# EAGLE design lqfp_adapters (EAGLE 7.4.0)
LQFP adapters for STM32 MCU
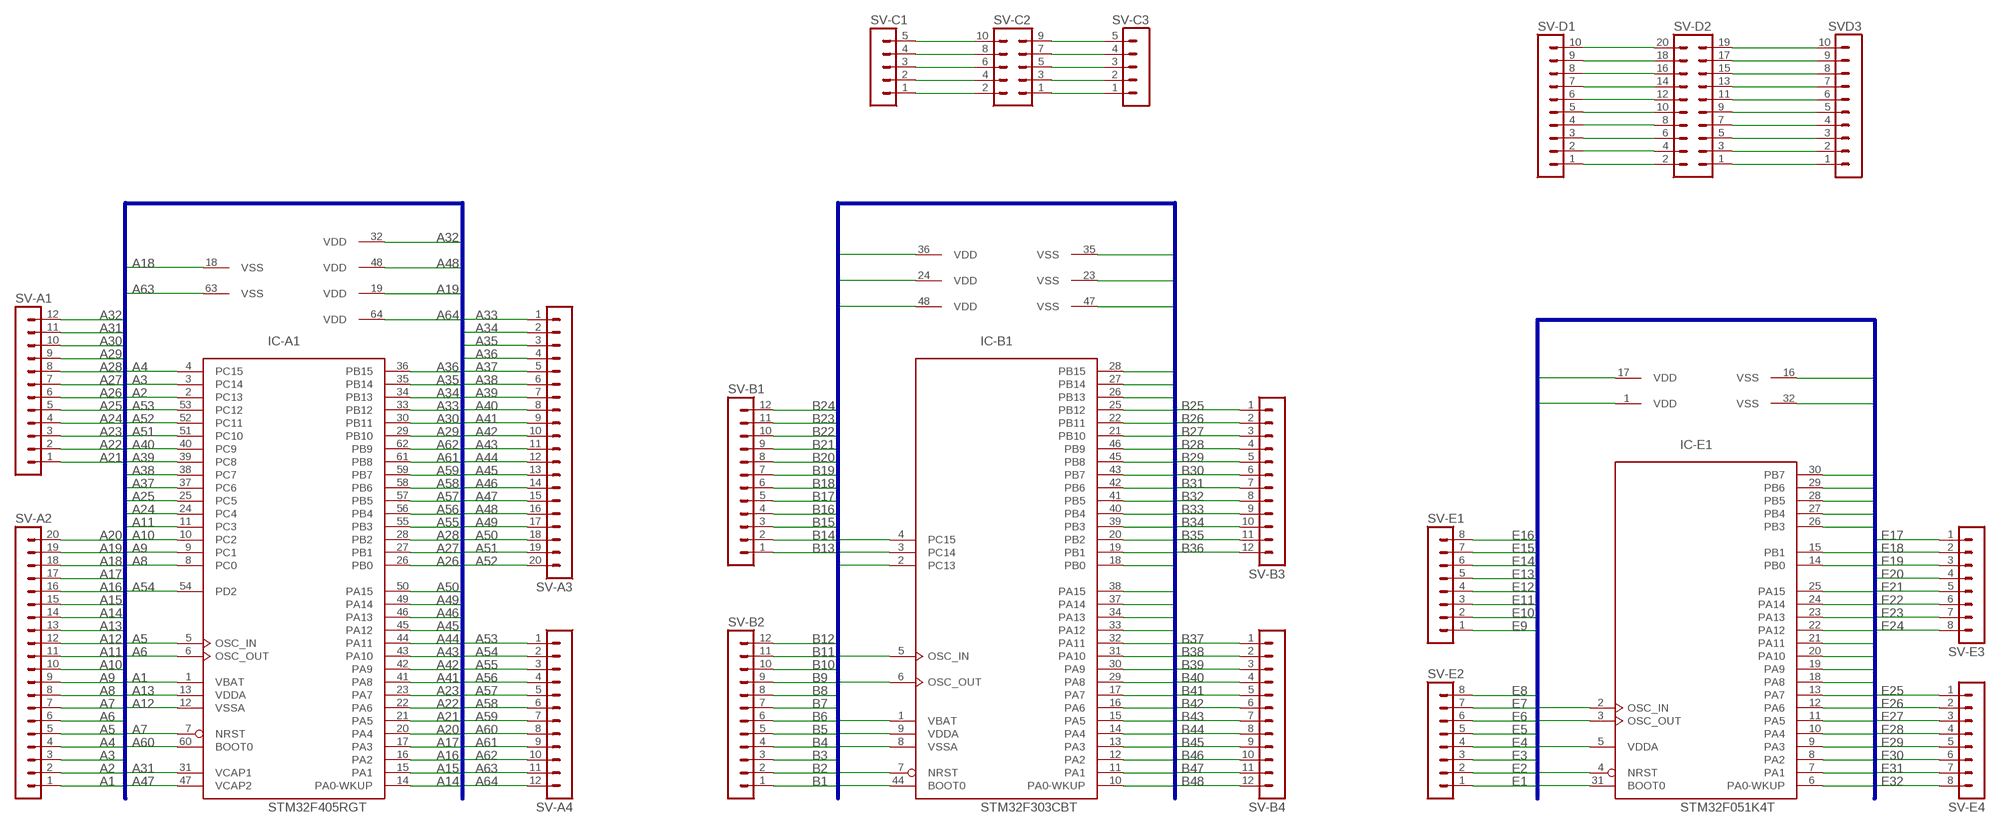
[diagram p0: schematic, sheet 1]

## Parts
IC-A1  STM32F405RGT  [LQFP64]
IC-B1  STM32F303CBT  [LQFP48]
IC-E1  STM32F051K4T  [LQFP32]
SV-A1  MA12-1NO-PL  [MA12-1-NO-PL]
SV-A2  MA20-1NO-PL  [MA20-1-NO-PL]
SV-A3  MA20-1NO-PL  [MA20-1-NO-PL]
SV-A4  MA12-1NO-PL  [MA12-1-NO-PL]
SV-B1  MA12-1NO-PL  [MA12-1-NO-PL]
SV-B2  MA12-1NO-PL  [MA12-1-NO-PL]
SV-B3  MA12-1NO-PL  [MA12-1-NO-PL]
SV-B4  MA12-1NO-PL  [MA12-1-NO-PL]
SV-C1  MA05-1NO-PL  [MA05-1-NO-PL]
SV-C2  MA05-2  [MA05-2]
SV-C3  MA05-1NO-PL  [MA05-1-NO-PL]
SV-D1  MA10-1NO-PL  [MA10-1-NO-PL]
SV-D2  MA10-2  [MA10-2]
SV-E1  MA08-1NO-PL  [MA08-1-NO-PL]
SV-E2  MA08-1NO-PL  [MA08-1-NO-PL]
SV-E3  MA08-1NO-PL  [MA08-1-NO-PL]
SV-E4  MA08-1NO-PL  [MA08-1-NO-PL]
SVD3  MA10-1NO-PL  [MA10-1-NO-PL]

## Nets
A1: IC-A1.1(VBAT) SV-A2.1
A2: IC-A1.2(PC13) SV-A2.2
A3: IC-A1.3(PC14) SV-A2.3
A4: IC-A1.4(PC15) SV-A2.4
A5: IC-A1.5(OSC_IN) SV-A2.5
A6: IC-A1.6(OSC_OUT) SV-A2.6
A7: IC-A1.7(NRST) SV-A2.7
A8: IC-A1.8(PC0) SV-A2.8
A9: IC-A1.9(PC1) SV-A2.9
A10: IC-A1.10(PC2) SV-A2.10
A11: IC-A1.11(PC3) SV-A2.11
A12: IC-A1.12(VSSA) SV-A2.12
A13: IC-A1.13(VDDA) SV-A2.13
A14: IC-A1.14(PA0-WKUP) SV-A2.14
A15: IC-A1.15(PA1) SV-A2.15
A16: IC-A1.16(PA2) SV-A2.16
A17: IC-A1.17(PA3) SV-A2.17
A18: IC-A1.18(VSS) SV-A2.18
A19: IC-A1.19(VDD) SV-A2.19
A20: IC-A1.20(PA4) SV-A2.20
A21: IC-A1.21(PA5) SV-A1.1
A22: IC-A1.22(PA6) SV-A1.2
A23: IC-A1.23(PA7) SV-A1.3
A24: IC-A1.24(PC4) SV-A1.4
A25: IC-A1.25(PC5) SV-A1.5
A26: IC-A1.26(PB0) SV-A1.6
A27: IC-A1.27(PB1) SV-A1.7
A28: IC-A1.28(PB2) SV-A1.8
A29: IC-A1.29(PB10) SV-A1.9
A30: IC-A1.30(PB11) SV-A1.10
A31: IC-A1.31(VCAP1) SV-A1.11
A32: IC-A1.32(VDD) SV-A1.12
A33: IC-A1.33(PB12) SV-A3.1
A34: IC-A1.34(PB13) SV-A3.2
A35: IC-A1.35(PB14) SV-A3.3
A36: IC-A1.36(PB15) SV-A3.4
A37: IC-A1.37(PC6) SV-A3.5
A38: IC-A1.38(PC7) SV-A3.6
A39: IC-A1.39(PC8) SV-A3.7
A40: IC-A1.40(PC9) SV-A3.8
A41: IC-A1.41(PA8) SV-A3.9
A42: IC-A1.42(PA9) SV-A3.10
A43: IC-A1.43(PA10) SV-A3.11
A44: IC-A1.44(PA11) SV-A3.12
A45: IC-A1.45(PA12) SV-A3.13
A46: IC-A1.46(PA13) SV-A3.14
A47: IC-A1.47(VCAP2) SV-A3.15
A48: IC-A1.48(VDD) SV-A3.16
A49: IC-A1.49(PA14) SV-A3.17
A50: IC-A1.50(PA15) SV-A3.18
A51: IC-A1.51(PC10) SV-A3.19
A52: IC-A1.52(PC11) SV-A3.20
A53: IC-A1.53(PC12) SV-A4.1
A54: IC-A1.54(PD2) SV-A4.2
A55: IC-A1.55(PB3) SV-A4.3
A56: IC-A1.56(PB4) SV-A4.4
A57: IC-A1.57(PB5) SV-A4.5
A58: IC-A1.58(PB6) SV-A4.6
A59: IC-A1.59(PB7) SV-A4.7
A60: IC-A1.60(BOOT0) SV-A4.8
A61: IC-A1.61(PB8) SV-A4.9
A62: IC-A1.62(PB9) SV-A4.10
A63: IC-A1.63(VSS) SV-A4.11
A64: IC-A1.64(VDD) SV-A4.12
B1: IC-B1.1(VBAT) SV-B2.1
B2: IC-B1.2(PC13) SV-B2.2
B3: IC-B1.3(PC14) SV-B2.3
B4: IC-B1.4(PC15) SV-B2.4
B5: IC-B1.5(OSC_IN) SV-B2.5
B6: IC-B1.6(OSC_OUT) SV-B2.6
B7: IC-B1.7(NRST) SV-B2.7
B8: IC-B1.8(VSSA) SV-B2.8
B9: IC-B1.9(VDDA) SV-B2.9
B10: IC-B1.10(PA0-WKUP) SV-B2.10
B11: IC-B1.11(PA1) SV-B2.11
B12: IC-B1.12(PA2) SV-B2.12
B13: IC-B1.13(PA3) SV-B1.1
B14: IC-B1.14(PA4) SV-B1.2
B15: IC-B1.15(PA5) SV-B1.3
B16: IC-B1.16(PA6) SV-B1.4
B17: IC-B1.17(PA7) SV-B1.5
B18: IC-B1.18(PB0) SV-B1.6
B19: IC-B1.19(PB1) SV-B1.7
B20: IC-B1.20(PB2) SV-B1.8
B21: IC-B1.21(PB10) SV-B1.9
B22: IC-B1.22(PB11) SV-B1.10
B23: IC-B1.23(VSS) SV-B1.11
B24: IC-B1.24(VDD) SV-B1.12
B25: IC-B1.25(PB12) SV-B3.1
B26: IC-B1.26(PB13) SV-B3.2
B27: IC-B1.27(PB14) SV-B3.3
B28: IC-B1.28(PB15) SV-B3.4
B29: IC-B1.29(PA8) SV-B3.5
B30: IC-B1.30(PA9) SV-B3.6
B31: IC-B1.31(PA10) SV-B3.7
B32: IC-B1.32(PA11) SV-B3.8
B33: IC-B1.33(PA12) SV-B3.9
B34: IC-B1.34(PA13) SV-B3.10
B35: IC-B1.35(VSS) SV-B3.11
B36: IC-B1.36(VDD) SV-B3.12
B37: IC-B1.37(PA14) SV-B4.1
B38: IC-B1.38(PA15) SV-B4.2
B39: IC-B1.39(PB3) SV-B4.3
B40: IC-B1.40(PB4) SV-B4.4
B41: IC-B1.41(PB5) SV-B4.5
B42: IC-B1.42(PB6) SV-B4.6
B43: IC-B1.43(PB7) SV-B4.7
B44: IC-B1.44(BOOT0) SV-B4.8
B45: IC-B1.45(PB8) SV-B4.9
B46: IC-B1.46(PB9) SV-B4.10
B47: IC-B1.47(VSS) SV-B4.11
B48: IC-B1.48(VDD) SV-B4.12
E1: IC-E1.1(VDD) SV-E2.1
E2: IC-E1.2(OSC_IN) SV-E2.2
E3: IC-E1.3(OSC_OUT) SV-E2.3
E4: IC-E1.4(NRST) SV-E2.4
E5: IC-E1.5(VDDA) SV-E2.5
E6: IC-E1.6(PA0-WKUP) SV-E2.6
E7: IC-E1.7(PA1) SV-E2.7
E8: IC-E1.8(PA2) SV-E2.8
E9: IC-E1.9(PA3) SV-E1.1
E10: IC-E1.10(PA4) SV-E1.2
E11: IC-E1.11(PA5) SV-E1.3
E12: IC-E1.12(PA6) SV-E1.4
E13: IC-E1.13(PA7) SV-E1.5
E14: IC-E1.14(PB0) SV-E1.6
E15: IC-E1.15(PB1) SV-E1.7
E16: IC-E1.16(VSS) SV-E1.8
E17: IC-E1.17(VDD) SV-E3.1
E18: IC-E1.18(PA8) SV-E3.2
E19: IC-E1.19(PA9) SV-E3.3
E20: IC-E1.20(PA10) SV-E3.4
E21: IC-E1.21(PA11) SV-E3.5
E22: IC-E1.22(PA12) SV-E3.6
E23: IC-E1.23(PA13) SV-E3.7
E24: IC-E1.24(PA14) SV-E3.8
E25: IC-E1.25(PA15) SV-E4.1
E26: IC-E1.26(PB3) SV-E4.2
E27: IC-E1.27(PB4) SV-E4.3
E28: IC-E1.28(PB5) SV-E4.4
E29: IC-E1.29(PB6) SV-E4.5
E30: IC-E1.30(PB7) SV-E4.6
E31: IC-E1.31(BOOT0) SV-E4.7
E32: IC-E1.32(VSS) SV-E4.8
N$1: SV-C2.1 SV-C3.1
N$2: SV-C2.3 SV-C3.2
N$3: SV-C2.5 SV-C3.3
N$4: SV-C2.7 SV-C3.4
N$5: SV-C2.9 SV-C3.5
N$6: SV-C1.1 SV-C2.2
N$7: SV-C1.2 SV-C2.4
N$8: SV-C1.3 SV-C2.6
N$9: SV-C1.4 SV-C2.8
N$10: SV-C1.5 SV-C2.10
N$11: SV-D2.1 SVD3.1
N$13: SV-D2.3 SVD3.2
N$14: SV-D2.5 SVD3.3
N$17: SV-D2.7 SVD3.4
N$22: SV-D2.9 SVD3.5
N$23: SV-D2.11 SVD3.6
N$24: SV-D2.13 SVD3.7
N$25: SV-D2.15 SVD3.8
N$26: SV-D2.17 SVD3.9
N$27: SV-D2.19 SVD3.10
N$28: SV-D1.10 SV-D2.20
N$29: SV-D1.9 SV-D2.18
N$31: SV-D1.8 SV-D2.16
N$32: SV-D1.7 SV-D2.14
N$33: SV-D1.6 SV-D2.12
N$34: SV-D1.5 SV-D2.10
N$35: SV-D1.4 SV-D2.8
N$36: SV-D1.3 SV-D2.6
N$37: SV-D1.2 SV-D2.4
N$38: SV-D1.1 SV-D2.2

## Buses
A
B
E

## Library data of the parts
IC-A1 = stm32:STM32F405R*T: ARM 32-bit Cortex™-M3 CPU 168 MHz maximum frequency 1024 Kbytes of Flash memory 192 kbytes of SRAM 51 GPIOs 1.8 to 3.6 V application supply
IC-B1 = stm32:STM32F303C*T: ARM 32-bit Cortex™-M3 CPU 72 MHz maximum frequency 128 to 256 Kbytes of Flash memory 32 to 40 kbytes of SRAM 37 GPIOs 2.0 to 3.6 V application supply
IC-E1 = stm32:STM32F051K*T: ARM 32-bit Cortex™-M0 CPU 48 MHz maximum frequency 16 to 32 Kbytes of Flash memory 4 kbytes of SRAM 25 GPIOs 2.0 to 3.6 V application supply
SV-A1 SV-A4 SV-B1-SV-B4 = MyComponents:MA12-1: PIN HEADER
SV-A2 SV-A3 = MyComponents:MA20-1: PIN HEADER
SV-C1 SV-C3 = MyComponents:MA05-1: PIN HEADER
SV-C2 = MyComponents:MA05-2: PIN HEADER; OC_FARNELL: unknown; OC_NEWARK: unknown
SV-D1 SVD3 = MyComponents:MA10-1: PIN HEADER
SV-D2 = MyComponents:MA10-2: PIN HEADER; OC_FARNELL: unknown; OC_NEWARK: unknown
SV-E1-SV-E4 = MyComponents:MA08-1: PIN HEADER

## Board
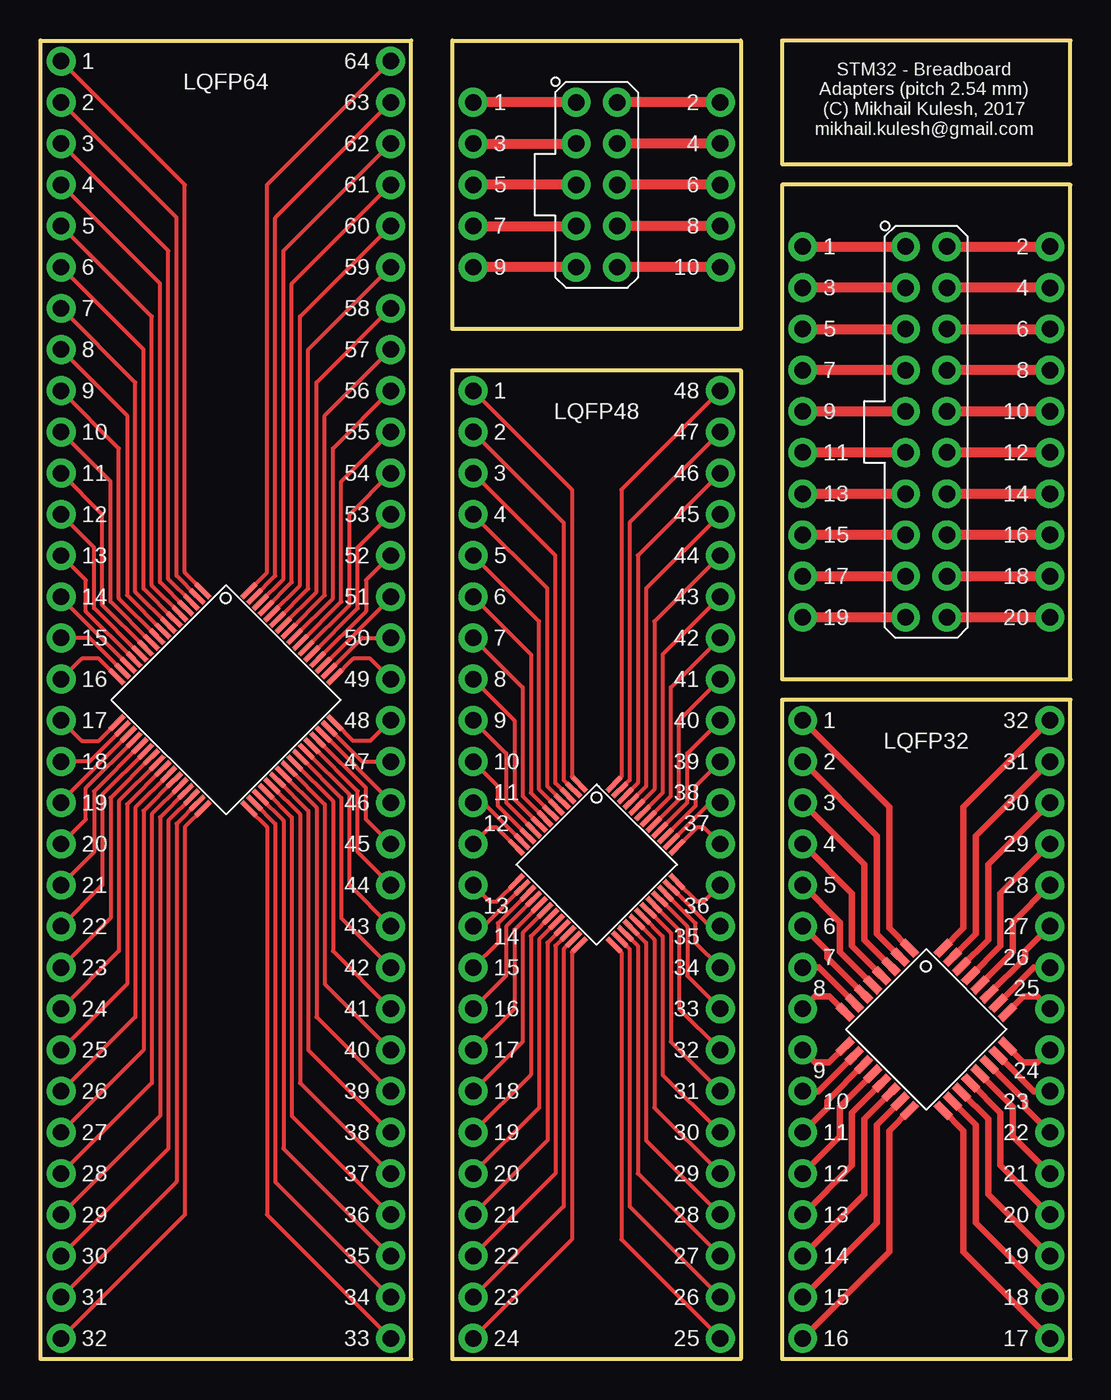
[diagram p1: board, top side]

Size 63.5 x 81.28 mm. Coordinates in mm from the lower left corner, seen from the top.
Outline: 0,0 0,81.28 22.86,81.28 22.86,0 0,0
Outline: 25.4,0 43.18,0 43.18,60.96 25.4,60.96 25.4,0
Outline: 45.72,0 63.5,0 63.5,40.64 45.72,40.64 45.72,0
Outline: 43.18,81.28 43.18,63.5 25.4,63.5 25.4,81.28 43.18,81.28
Outline: 63.5,72.39 45.72,72.39 45.72,41.91 63.5,41.91 63.5,72.39
Outline: 45.72,81.28 45.72,73.66 63.5,73.66 63.5,81.28 45.72,81.28
Copper layers (1*16): Top 0.035mm / dielectric 1.5mm / Bottom 0.035mm
Design rules "eagle": minimum track width 10mil, minimum drill 19mil, track to track 8mil, track to pad 8mil, pad to pad 7mil, via to via 12mil, smd to smd 7mil, copper to edge 10mil, drill to drill 30mil, minimum pad ring 15mil, minimum via ring 8mil, stop-mask expansion 4mil, vias tented up to drill 0mil, thermal gap 10mil

### Footprints (pad centres in the part's own frame; a part is rotated, then mirrored left to right if it is on the bottom)
LQFP64 = smd 0.3 x 1.2: 1 -3.75,-5.75; 2 -3.25,-5.75; 3 -2.75,-5.75; 4 -2.25,-5.75; 5 -1.75,-5.75; 6 -1.25,-5.75; 7 -0.75,-5.75; 8 -0.25,-5.75; 9 0.25,-5.75; 10 0.75,-5.75; 11 1.25,-5.75; 12 1.75,-5.75; 13 2.25,-5.75; 14 2.75,-5.75; 15 3.25,-5.75; 16 3.75,-5.75; 33 3.75,5.75; 34 3.25,5.75; 35 2.75,5.75; 36 2.25,5.75; 37 1.75,5.75; 38 1.25,5.75; 39 0.75,5.75; 40 0.25,5.75; 41 -0.25,5.75; 42 -0.75,5.75; 43 -1.25,5.75; 44 -1.75,5.75; 45 -2.25,5.75; 46 -2.75,5.75; 47 -3.25,5.75; 48 -3.75,5.75 | smd 1.2 x 0.3: 17 5.75,-3.75; 18 5.75,-3.25; 19 5.75,-2.75; 20 5.75,-2.25; 21 5.75,-1.75; 22 5.75,-1.25; 23 5.75,-0.75; 24 5.75,-0.25; 25 5.75,0.25; 26 5.75,0.75; 27 5.75,1.25; 28 5.75,1.75; 29 5.75,2.25; 30 5.75,2.75; 31 5.75,3.25; 32 5.75,3.75; 49 -5.75,3.75; 50 -5.75,3.25; 51 -5.75,2.75; 52 -5.75,2.25; 53 -5.75,1.75; 54 -5.75,1.25; 55 -5.75,0.75; 56 -5.75,0.25; 57 -5.75,-0.25; 58 -5.75,-0.75; 59 -5.75,-1.25; 60 -5.75,-1.75; 61 -5.75,-2.25; 62 -5.75,-2.75; 63 -5.75,-3.25; 64 -5.75,-3.75
LQFP48 = smd 0.3 x 1.2: 1 -2.75,-4.25; 2 -2.25,-4.25; 3 -1.75,-4.25; 4 -1.25,-4.25; 5 -0.75,-4.25; 6 -0.25,-4.25; 7 0.25,-4.25; 8 0.75,-4.25; 9 1.25,-4.25; 10 1.75,-4.25; 11 2.25,-4.25; 12 2.75,-4.25; 25 2.75,4.25; 26 2.25,4.25; 27 1.75,4.25; 28 1.25,4.25; 29 0.75,4.25; 30 0.25,4.25; 31 -0.25,4.25; 32 -0.75,4.25; 33 -1.25,4.25; 34 -1.75,4.25; 35 -2.25,4.25; 36 -2.75,4.25 | smd 1.2 x 0.3: 13 4.25,-2.75; 14 4.25,-2.25; 15 4.25,-1.75; 16 4.25,-1.25; 17 4.25,-0.75; 18 4.25,-0.25; 19 4.25,0.25; 20 4.25,0.75; 21 4.25,1.25; 22 4.25,1.75; 23 4.25,2.25; 24 4.25,2.75; 37 -4.25,2.75; 38 -4.25,2.25; 39 -4.25,1.75; 40 -4.25,1.25; 41 -4.25,0.75; 42 -4.25,0.25; 43 -4.25,-0.25; 44 -4.25,-0.75; 45 -4.25,-1.25; 46 -4.25,-1.75; 47 -4.25,-2.25; 48 -4.25,-2.75
LQFP32 = smd 0.5 x 1.2: 1 -2.8,-4.275; 2 -2,-4.275; 3 -1.2,-4.275; 4 -0.4,-4.275; 5 0.4,-4.275; 6 1.19,-4.275; 7 1.99,-4.275; 8 2.79,-4.275; 17 2.8,4.275; 18 2,4.275; 19 1.2,4.275; 20 0.4,4.275; 21 -0.4,4.275; 22 -1.2,4.275; 23 -2,4.275; 24 -2.8,4.275 | smd 1.2 x 0.5: 9 4.275,-2.8; 10 4.275,-2; 11 4.275,-1.2; 12 4.275,-0.4; 13 4.275,0.4; 14 4.275,1.2; 15 4.275,2; 16 4.275,2.8; 25 -4.275,2.8; 26 -4.275,2; 27 -4.275,1.2; 28 -4.275,0.4; 29 -4.275,-0.4; 30 -4.275,-1.2; 31 -4.275,-2; 32 -4.275,-2.8
MA12-1-NO-PL = drill 1.016: 1 -13.97,0; 2 -11.43,0; 3 -8.89,0; 4 -6.35,0; 5 -3.81,0; 6 -1.27,0; 7 1.27,0; 8 3.81,0; 9 6.35,0; 10 8.89,0; 11 11.43,0; 12 13.97,0
MA20-1-NO-PL = drill 1.016: 1 -24.13,0; 2 -21.59,0; 3 -19.05,0; 4 -16.51,0; 5 -13.97,0; 6 -11.43,0; 7 -8.89,0; 8 -6.35,0; 9 -3.81,0; 10 -1.27,0; 11 1.27,0; 12 3.81,0; 13 6.35,0; 14 8.89,0; 15 11.43,0; 16 13.97,0; 17 16.51,0; 18 19.05,0; 19 21.59,0; 20 24.13,0
MA05-1-NO-PL = drill 1.016: 1 -5.08,0; 2 -2.54,0; 3 0,0; 4 2.54,0; 5 5.08,0
MA05-2 = drill 1.016: 1 -5.08,-1.27; 2 -5.08,1.27; 3 -2.54,-1.27; 4 -2.54,1.27; 5 0,-1.27; 6 0,1.27; 7 2.54,-1.27; 8 2.54,1.27; 9 5.08,-1.27; 10 5.08,1.27
MA10-1-NO-PL = drill 1.016: 1 -11.43,0; 2 -8.89,0; 3 -6.35,0; 4 -3.81,0; 5 -1.27,0; 6 1.27,0; 7 3.81,0; 8 6.35,0; 9 8.89,0; 10 11.43,0
MA10-2 = drill 1.016: 1 -11.43,-1.27; 2 -11.43,1.27; 3 -8.89,-1.27; 4 -8.89,1.27; 5 -6.35,-1.27; 6 -6.35,1.27; 7 -3.81,-1.27; 8 -3.81,1.27; 9 -1.27,-1.27; 10 -1.27,1.27; 11 1.27,-1.27; 12 1.27,1.27; 13 3.81,-1.27; 14 3.81,1.27; 15 6.35,-1.27; 16 6.35,1.27; 17 8.89,-1.27; 18 8.89,1.27; 19 11.43,-1.27; 20 11.43,1.27
MA08-1-NO-PL = drill 1.016: 1 -8.89,0; 2 -6.35,0; 3 -3.81,0; 4 -1.27,0; 5 1.27,0; 6 3.81,0; 7 6.35,0; 8 8.89,0

### Placement (x,y rotation side)
IC-A1  11.43,40.64 225 top
IC-B1  34.29,30.48 225 top
IC-E1  54.61,20.32 225 top
SV-A1  1.27,15.24 270 bottom
SV-A2  1.27,55.88 270 bottom
SV-A3  21.59,25.4 90 bottom
SV-A4  21.59,66.04 90 bottom
SV-B1  26.67,15.24 270 bottom
SV-B2  26.67,45.72 270 bottom
SV-B3  41.91,15.24 90 bottom
SV-B4  41.91,45.72 90 bottom
SV-C1  41.91,72.39 270 bottom
SV-C2  34.29,72.39 270 top
SV-C3  26.67,72.39 270 bottom
SV-D1  62.23,57.15 270 bottom
SV-D2  54.61,57.15 270 top
SV-E1  46.99,10.16 270 bottom
SV-E2  46.99,30.48 270 bottom
SV-E3  62.23,10.16 90 bottom
SV-E4  62.23,30.48 90 bottom
SVD3  46.99,57.15 270 bottom

### Tracks (layer width: path | path; a pad name or v marks a point on that pad's centre or on a via)
A1
  Top 0.254: SV-A2.1 8.89,72.39 8.89,48.48 IC-A1.1
A2
  Top 0.254: SV-A2.2 8.38,70.36 8.38,48.28 IC-A1.2
A3
  Top 0.254: SV-A2.3 7.87,68.33 7.87,48.09 IC-A1.3
A4
  Top 0.254: IC-A1.4 7.37,47.89 7.37,66.29 SV-A2.4
A5
  Top 0.254: IC-A1.5 6.86,47.69 6.86,64.26 SV-A2.5
A6
  Top 0.254: IC-A1.6 6.35,47.49 6.35,62.23 SV-A2.6
A7
  Top 0.254: IC-A1.7 5.84,47.29 5.84,60.2 SV-A2.7
A8
  Top 0.254: IC-A1.8 5.33,47.09 5.33,58.17 SV-A2.8
A9
  Top 0.254: IC-A1.9 4.83,46.89 4.83,56.13 SV-A2.9
A10
  Top 0.254: IC-A1.10 4.32,46.69 4.32,54.1 SV-A2.10
A11
  Top 0.254: IC-A1.11 3.81,46.49 3.81,52.07 SV-A2.11
A12
  Top 0.254: IC-A1.12 3.3,46.29 3.3,50.04 SV-A2.12
A13
  Top 0.254: IC-A1.13 2.79,46.09 2.79,48.01 SV-A2.13
A14
  Top 0.254: IC-A1.14 1.27,46.91 SV-A2.14
A15
  Top 0.254: IC-A1.15 3.02,44.45 SV-A2.15
A16
  Top 0.254: IC-A1.16 3.59,43.18 2.54,43.18 SV-A2.16
A17
  Top 0.254: IC-A1.17 3.59,38.1 2.54,38.1 SV-A2.17
A18
  Top 0.254: IC-A1.18 3.02,36.83 SV-A2.18
A19
  Top 0.254: IC-A1.19 1.27,34.37 SV-A2.19
A20
  Top 0.254: SV-A2.20 2.79,33.27 2.79,35.19 IC-A1.20
A21
  Top 0.254: SV-A1.1 3.3,31.24 3.3,34.99 IC-A1.21
A22
  Top 0.254: SV-A1.2 3.81,29.21 3.81,34.79 IC-A1.22
A23
  Top 0.254: SV-A1.3 4.32,27.18 4.32,34.59 IC-A1.23
A24
  Top 0.254: SV-A1.4 4.83,25.15 4.83,34.39 IC-A1.24
A25
  Top 0.254: SV-A1.5 5.33,23.11 5.33,34.19 IC-A1.25
A26
  Top 0.254: SV-A1.6 5.84,21.08 5.84,33.99 IC-A1.26
A27
  Top 0.254: SV-A1.7 6.35,19.05 6.35,33.79 IC-A1.27
A28
  Top 0.254: SV-A1.8 6.86,17.02 6.86,33.59 IC-A1.28
A29
  Top 0.254: SV-A1.9 7.37,14.99 7.37,33.39 IC-A1.29
A30
  Top 0.254: SV-A1.10 7.87,12.95 7.87,33.2 IC-A1.30
A31
  Top 0.254: SV-A1.11 8.38,10.92 8.38,33 IC-A1.31
A32
  Top 0.254: SV-A1.12 8.89,8.89 8.89,32.8 IC-A1.32
A33
  Top 0.254: IC-A1.33 13.97,32.8 13.97,8.89 SV-A3.1
A34
  Top 0.254: IC-A1.34 14.48,33 14.48,10.92 SV-A3.2
A35
  Top 0.254: IC-A1.35 14.99,33.2 14.99,12.95 SV-A3.3
A36
  Top 0.254: IC-A1.36 15.49,33.39 15.49,14.99 SV-A3.4
A37
  Top 0.254: IC-A1.37 16,33.59 16,17.02 SV-A3.5
A38
  Top 0.254: IC-A1.38 16.51,33.79 16.51,19.05 SV-A3.6
A39
  Top 0.254: IC-A1.39 17.02,33.99 17.02,21.08 SV-A3.7
A40
  Top 0.254: IC-A1.40 17.53,34.19 17.53,23.11 SV-A3.8
A41
  Top 0.254: IC-A1.41 18.03,34.39 18.03,25.15 SV-A3.9
A42
  Top 0.254: IC-A1.42 18.54,34.59 18.54,27.18 SV-A3.10
A43
  Top 0.254: IC-A1.43 19.05,34.79 19.05,29.21 SV-A3.11
A44
  Top 0.254: IC-A1.44 19.56,34.99 19.56,31.24 SV-A3.12
A45
  Top 0.254: IC-A1.45 20.07,35.19 20.07,33.27 SV-A3.13
A46
  Top 0.254: IC-A1.46 21.59,34.37 SV-A3.14
A47
  Top 0.254: IC-A1.47 19.84,36.83 SV-A3.15
A48
  Top 0.254: IC-A1.48 19.27,38.1 20.32,38.1 SV-A3.16
A49
  Top 0.254: IC-A1.49 19.27,43.18 20.32,43.18 SV-A3.17
A50
  Top 0.254: IC-A1.50 19.84,44.45 SV-A3.18
A51
  Top 0.254: IC-A1.51 21.59,46.91 SV-A3.19
A52
  Top 0.254: IC-A1.52 20.07,46.09 20.07,48.01 SV-A3.20
A53
  Top 0.254: IC-A1.53 19.56,46.29 19.56,50.04 SV-A4.1
A54
  Top 0.254: IC-A1.54 19.05,46.49 19.05,52.07 SV-A4.2
A55
  Top 0.254: IC-A1.55 18.54,46.69 18.54,54.1 SV-A4.3
A56
  Top 0.254: IC-A1.56 18.03,46.89 18.03,56.13 SV-A4.4
A57
  Top 0.254: IC-A1.57 17.53,47.09 17.53,58.17 SV-A4.5
A58
  Top 0.254: IC-A1.58 17.02,47.29 17.02,60.2 SV-A4.6
A59
  Top 0.254: IC-A1.59 16.51,47.49 16.51,62.23 SV-A4.7
A60
  Top 0.254: IC-A1.60 16,47.69 16,64.26 SV-A4.8
A61
  Top 0.254: IC-A1.61 15.49,47.89 15.49,66.29 SV-A4.9
A62
  Top 0.254: IC-A1.62 14.99,48.09 14.99,68.33 SV-A4.10
A63
  Top 0.254: IC-A1.63 14.48,48.28 14.48,70.36 SV-A4.11
A64
  Top 0.254: IC-A1.64 13.97,48.48 13.97,72.39 SV-A4.12
B1
  Top 0.254: SV-B2.1 32.77,53.59 32.77,35.89 IC-B1.1
B2
  Top 0.254: SV-B2.2 32.26,51.56 32.26,35.69 IC-B1.2
B3
  Top 0.254: SV-B2.3 31.75,49.53 31.75,35.49 IC-B1.3
B4
  Top 0.254: SV-B2.4 31.24,47.5 31.24,35.3 IC-B1.4
B5
  Top 0.254: SV-B2.5 30.73,45.47 30.73,35.1 IC-B1.5
B6
  Top 0.254: SV-B2.6 30.23,43.43 30.23,34.9 IC-B1.6
B7
  Top 0.254: SV-B2.7 29.72,41.4 29.72,34.7 IC-B1.7
B8
  Top 0.254: SV-B2.8 29.21,39.37 29.21,34.5 IC-B1.8
B9
  Top 0.254: SV-B2.9 28.7,37.34 28.7,34.3 IC-B1.9
B10
  Top 0.254: IC-B1.10 28.19,34.1 28.19,35.31 SV-B2.10
B11
  Top 0.254: IC-B1.11 27.3,34.29 SV-B2.11
B12
  Top 0.254: IC-B1.12 28.11,32.77 27.69,32.77 SV-B2.12
B13
  Top 0.254: IC-B1.13 28.11,28.19 27.69,28.19 SV-B1.1
B14
  Top 0.254: IC-B1.14 27.3,26.67 SV-B1.2
B15
  Top 0.254: IC-B1.15 28.19,26.86 28.19,25.65 SV-B1.3
B16
  Top 0.254: SV-B1.4 28.7,23.62 28.7,26.66 IC-B1.16
B17
  Top 0.254: SV-B1.5 29.21,21.59 29.21,26.46 IC-B1.17
B18
  Top 0.254: SV-B1.6 29.72,19.56 29.72,26.26 IC-B1.18
B19
  Top 0.254: SV-B1.7 30.23,17.53 30.23,26.06 IC-B1.19
B20
  Top 0.254: SV-B1.8 30.73,15.49 30.73,25.86 IC-B1.20
B21
  Top 0.254: SV-B1.9 31.24,13.46 31.24,25.66 IC-B1.21
B22
  Top 0.254: SV-B1.10 31.75,11.43 31.75,25.46 IC-B1.22
B23
  Top 0.254: SV-B1.11 32.26,9.4 32.26,25.27 IC-B1.23
B24
  Top 0.254: SV-B1.12 32.77,7.37 32.77,25.07 IC-B1.24
B25
  Top 0.254: IC-B1.25 35.81,25.07 35.81,7.37 SV-B3.1
B26
  Top 0.254: IC-B1.26 36.32,25.27 36.32,9.4 SV-B3.2
B27
  Top 0.254: IC-B1.27 36.83,25.46 36.83,11.43 SV-B3.3
B28
  Top 0.254: IC-B1.28 37.34,25.66 37.34,13.46 SV-B3.4
B29
  Top 0.254: IC-B1.29 37.85,25.86 37.85,15.49 SV-B3.5
B30
  Top 0.254: IC-B1.30 38.35,26.06 38.35,17.53 SV-B3.6
B31
  Top 0.254: IC-B1.31 38.86,26.26 38.86,19.56 SV-B3.7
B32
  Top 0.254: IC-B1.32 39.37,26.46 39.37,21.59 SV-B3.8
B33
  Top 0.254: IC-B1.33 39.88,26.66 39.88,23.62 SV-B3.9
B34
  Top 0.254: IC-B1.34 40.39,26.86 40.39,25.65 SV-B3.10
B35
  Top 0.254: IC-B1.35 41.28,26.67 SV-B3.11
B36
  Top 0.254: IC-B1.36 40.47,28.19 40.89,28.19 SV-B3.12
B37
  Top 0.254: IC-B1.37 40.47,32.77 40.89,32.77 SV-B4.1
B38
  Top 0.254: IC-B1.38 41.28,34.29 SV-B4.2
B39
  Top 0.254: IC-B1.39 40.39,34.1 40.39,35.31 SV-B4.3
B40
  Top 0.254: IC-B1.40 39.88,34.3 39.88,37.34 SV-B4.4
B41
  Top 0.254: IC-B1.41 39.37,34.5 39.37,39.37 SV-B4.5
B42
  Top 0.254: IC-B1.42 38.86,34.7 38.86,41.4 SV-B4.6
B43
  Top 0.254: IC-B1.43 38.35,34.9 38.35,43.43 SV-B4.7
B44
  Top 0.254: IC-B1.44 37.85,35.1 37.85,45.47 SV-B4.8
B45
  Top 0.254: IC-B1.45 37.34,35.3 37.34,47.5 SV-B4.9
B46
  Top 0.254: IC-B1.46 36.83,35.49 36.83,49.53 SV-B4.10
B47
  Top 0.254: IC-B1.47 36.32,35.69 36.32,51.56 SV-B4.11
B48
  Top 0.254: IC-B1.48 35.81,35.89 35.81,53.59 SV-B4.12
E1
  Top 0.406: IC-E1.1 52.32,26.57 52.32,34.04 SV-E2.1
E2
  Top 0.406: IC-E1.2 51.56,26.2 51.56,32.26 SV-E2.2
E3
  Top 0.406: IC-E1.3 50.8,25.83 50.8,30.48 SV-E2.3
E4
  Top 0.406: IC-E1.4 50.04,25.46 50.04,28.7 SV-E2.4
E5
  Top 0.406: IC-E1.5 49.28,25.09 49.28,26.92 SV-E2.5
E6
  Top 0.406: IC-E1.6 48.51,24.73 48.51,25.15 SV-E2.6
E7
  Top 0.406: IC-E1.7 47.99,24.13 SV-E2.7
E8
  Top 0.406: IC-E1.8 48.63,22.35 47.75,22.35 SV-E2.8
E9
  Top 0.406: IC-E1.9 48.62,18.29 47.75,18.29 SV-E1.1
E10
  Top 0.406: IC-E1.10 47.97,16.51 SV-E1.2
E11
  Top 0.406: IC-E1.11 48.51,15.92 48.51,15.49 SV-E1.3
E12
  Top 0.406: IC-E1.12 49.28,15.55 49.28,13.72 SV-E1.4
E13
  Top 0.406: IC-E1.13 50.04,15.18 50.04,11.94 SV-E1.5
E14
  Top 0.406: IC-E1.14 50.8,14.81 50.8,10.16 SV-E1.6
E15
  Top 0.406: IC-E1.15 51.56,14.44 51.56,8.38 SV-E1.7
E16
  Top 0.406: IC-E1.16 52.32,14.07 52.32,6.6 SV-E1.8
E17
  Top 0.406: IC-E1.17 56.9,14.07 56.9,6.6 SV-E3.1
E18
  Top 0.406: IC-E1.18 57.66,14.44 57.66,8.38 SV-E3.2
E19
  Top 0.406: IC-E1.19 58.42,14.81 58.42,10.16 SV-E3.3
E20
  Top 0.406: IC-E1.20 59.18,15.18 59.18,11.94 SV-E3.4
E21
  Top 0.406: IC-E1.21 59.94,15.55 59.94,13.72 SV-E3.5
E22
  Top 0.406: IC-E1.22 60.71,15.92 60.71,15.49 SV-E3.6
E23
  Top 0.406: IC-E1.23 61.25,16.51 SV-E3.7
E24
  Top 0.406: IC-E1.24 60.6,18.29 61.47,18.29 SV-E3.8
E25
  Top 0.406: IC-E1.25 60.6,22.35 61.47,22.35 SV-E4.1
E26
  Top 0.406: IC-E1.26 61.25,24.13 SV-E4.2
E27
  Top 0.406: IC-E1.27 60.71,24.72 60.71,25.15 SV-E4.3
E28
  Top 0.406: IC-E1.28 59.94,25.09 59.94,26.92 SV-E4.4
E29
  Top 0.406: IC-E1.29 59.18,25.46 59.18,28.7 SV-E4.5
E30
  Top 0.406: IC-E1.30 58.42,25.83 58.42,30.48 SV-E4.6
E31
  Top 0.406: IC-E1.31 57.66,26.2 57.66,32.26 SV-E4.7
E32
  Top 0.406: IC-E1.32 56.9,26.57 56.9,34.04 SV-E4.8
N$1
  Top 0.61: SV-C2.1 SV-C3.1
N$2
  Top 0.61: SV-C3.2 SV-C2.3
N$3
  Top 0.61: SV-C2.5 SV-C3.3
N$4
  Top 0.61: SV-C3.4 SV-C2.7
N$5
  Top 0.61: SV-C2.9 SV-C3.5
N$6
  Top 0.61: SV-C1.1 SV-C2.2
N$7
  Top 0.61: SV-C1.2 SV-C2.4
N$8
  Top 0.61: SV-C1.3 SV-C2.6
N$9
  Top 0.61: SV-C1.4 SV-C2.8
N$10
  Top 0.61: SV-C1.5 SV-C2.10
N$11
  Top 0.61: SVD3.1 SV-D2.1
N$13
  Top 0.61: SV-D2.3 SVD3.2
N$14
  Top 0.61: SVD3.3 SV-D2.5
N$17
  Top 0.61: SV-D2.7 SVD3.4
N$22
  Top 0.61: SVD3.5 SV-D2.9
N$23
  Top 0.61: SV-D2.11 SVD3.6
N$24
  Top 0.61: SVD3.7 SV-D2.13
N$25
  Top 0.61: SV-D2.15 SVD3.8
N$26
  Top 0.61: SVD3.9 SV-D2.17
N$27
  Top 0.61: SV-D2.19 SVD3.10
N$28
  Top 0.61: SV-D1.10 SV-D2.20
N$29
  Top 0.61: SV-D2.18 SV-D1.9
N$31
  Top 0.61: SV-D1.8 SV-D2.16
N$32
  Top 0.61: SV-D2.14 SV-D1.7
N$33
  Top 0.61: SV-D1.6 SV-D2.12
N$34
  Top 0.61: SV-D2.10 SV-D1.5
N$35
  Top 0.61: SV-D1.4 SV-D2.8
N$36
  Top 0.61: SV-D2.6 SV-D1.3
N$37
  Top 0.61: SV-D1.2 SV-D2.4
N$38
  Top 0.61: SV-D2.2 SV-D1.1

### Text on the board
tNames: 1 | 64 | LQFP64 | STM32 - Breadboard / Adapters (pitch 2.54 mm) / (C) Mikhail Kulesh, 2017 / mikhail.kulesh@gmail.com | 2 | 63 | 1 | 2 | 3 | 62 | 3 | 4 | 4 | 61 | 5 | 6 | 5 | 60 | 7 | 8 | 1 | 2 | 6 | 59 | 9 | 10 | 3 | 4 | 7 | 58 | 5 | 6 | 8 | 57 | 7 | 8 | 9 | 56 | 1 | 48 | LQFP48 | 9 | 10 | 10 | 55 | 2 | 47 | 11 | 12 | 11 | 54 | 3 | 46 | 13 | 14 | 12 | 53 | 4 | 45 | 15 | 16 | 13 | 52 | 5 | 44 | 17 | 18 | 14 | 51 | 6 | 43 | 19 | 20 | 15 | 50 | 7 | 42 | 16 | 49 | 8 | 41 | 17 | 48 | 9 | 40 | 1 | 32 | LQFP32 | 18 | 47 | 10 | 39 | 2 | 31 | 11 | 38 | 19 | 46 | 3 | 30 | 12 | 37 | 20 | 45 | 4 | 29 | 21 | 44 | 5 | 28 | 13 | 36 | 22 | 43 | 6 | 27 | 14 | 35 | 7 | 26 | 23 | 42 | 15 | 34 | 8 | 25 | 24 | 41 | 16 | 33 | 25 | 40 | 17 | 32 | 9 | 24 | 26 | 39 | 18 | 31 | 10 | 23 | 27 | 38 | 19 | 30 | 11 | 22 | 28 | 37 | 20 | 29 | 12 | 21 | 29 | 36 | 21 | 28 | 13 | 20 | 30 | 35 | 22 | 27 | 14 | 19 | 31 | 34 | 23 | 26 | 15 | 18 | 32 | 33 | 24 | 25 | 16 | 17